# Altium schematic sheet ColourConverter.SchDoc: LiveDesign Evaluation - EvalBoard Tester
size A4; Organization: Altium Limited; Address1: L3, 12a Rodborough Rd; Address2: Frenchs Forest; Address3: NSW; Address4: Australia 2086; DocumentNumber: 9; SheetNumber: 9; SheetTotal: 16
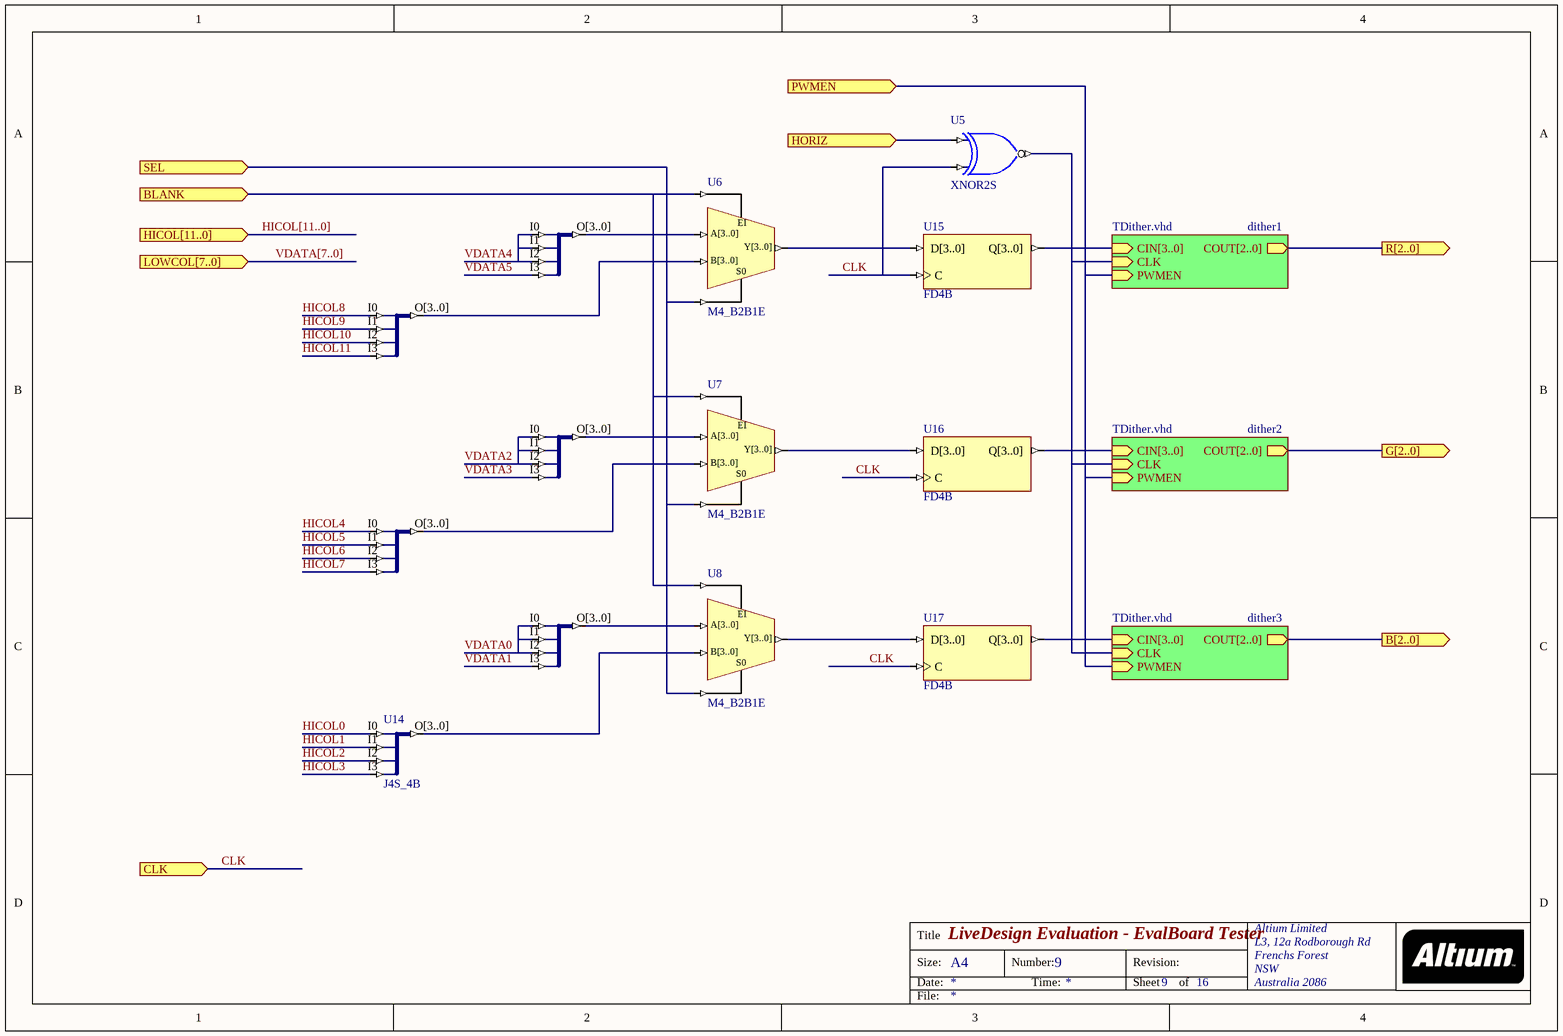
[diagram p0: ColourConverter.SchDoc]

## Parts
U5  XNOR2S
U6  M4_B2B1E
U7  M4_B2B1E
U8  M4_B2B1E
U9  J4S_4B  (value not drawn)
U10  J4S_4B  (value not drawn)
U11  J4S_4B  (value not drawn)
U12  J4S_4B  (value not drawn)
U13  J4S_4B  (value not drawn)
U14  J4S_4B
U15  FD4B
U16  FD4B
U17  FD4B

## Sub-sheets
dither1 = TDither.vhd: CIN[3..0] (in), COUT[2..0] (out), CLK (in), PWMEN (in)
dither2 = TDither.vhd: CIN[3..0] (in), COUT[2..0] (out), CLK (in), PWMEN (in)
dither3 = TDither.vhd: CIN[3..0] (in), COUT[2..0] (out), CLK (in), PWMEN (in)

## Ports
B[2..0] (out), BLANK (in), CLK (in), G[2..0] (out), HICOL[11..0] (in), HORIZ (in), LOWCOL[7..0] (in), PWMEN (in), R[2..0] (out), SEL (in)

## Nets
BLANK: U6.EI U7.EI U8.EI ; port BLANK
CLK: U5.I1 U15.C U16.C U17.C ; port CLK
HICOL0: U14.I0
HICOL1: U14.I1
HICOL2: U14.I2
HICOL3: U14.I3
HICOL4: U12.I0
HICOL5: U12.I1
HICOL6: U12.I2
HICOL7: U12.I3
HICOL8: U10.I0
HICOL9: U10.I1
HICOL10: U10.I2
HICOL11: U10.I3
HORIZ: U5.I0 ; port HORIZ
PWMEN: port PWMEN, sheet dither1/PWMEN, sheet dither2/PWMEN, sheet dither3/PWMEN
SEL: U6.S0 U7.S0 U8.S0 ; port SEL
VDATA0: U13.I0 U13.I1 U13.I2
VDATA1: U13.I3
VDATA2: U11.I0 U11.I1 U11.I2
VDATA3: U11.I3
VDATA4: U9.I0 U9.I1 U9.I2
VDATA5: U9.I3
NetU5_O: U5.O ; sheet dither1/CLK, sheet dither2/CLK, sheet dither3/CLK
NetU6_A[3..0]: U6.A[3..0] U9.O[3..0]
NetU6_B[3..0]: U6.B[3..0] U10.O[3..0]
NetU6_Y[3..0]: U6.Y[3..0] U15.D[3..0]
NetU7_A[3..0]: U7.A[3..0] U11.O[3..0]
NetU7_B[3..0]: U7.B[3..0] U12.O[3..0]
NetU7_Y[3..0]: U7.Y[3..0] U16.D[3..0]
NetU8_A[3..0]: U8.A[3..0] U13.O[3..0]
NetU8_B[3..0]: U8.B[3..0] U14.O[3..0]
NetU8_Y[3..0]: U8.Y[3..0] U17.D[3..0]
NetU15_Q[3..0]: U15.Q[3..0] ; sheet dither1/CIN[3..0]
NetU16_Q[3..0]: U16.Q[3..0] ; sheet dither2/CIN[3..0]
NetU17_Q[3..0]: U17.Q[3..0] ; sheet dither3/CIN[3..0]

## Buses and harness runs
bus HICOL[11..0] = port HICOL[11..0]
bus port B[2..0] = sheet dither3/COUT[2..0]
bus port G[2..0] = sheet dither2/COUT[2..0]
bus port R[2..0] = sheet dither1/COUT[2..0]
bus VDATA[7..0] = port LOWCOL[7..0]

## Notes on the sheet
- Title
- Size:
- Date:
- A4
- Number:
- Time:
- Revision:
- Sheet
- of
- File:

## Library data of the parts
U5 = XNOR2S: 2-Input Exclusive-NOR Gate, Single Pin Version; Xilinx Equivalent: XNOR2; ArchiveName: GENERIC; VHDLIB_SIM: GENERIC_LIB; Published: 29-Jan-2004; Publisher: Altium Limited; Core Revision: 1.00.00
U6-U8 = M4_B2B1E: 2x4-Bit Bus to 1x4-Bit Bus Multiplexer With Enable; ArchiveName: GENERIC; VHDLIB_SIM: GENERIC_LIB; Published: 29-Jan-2004; Publisher: Altium Limited; Core Revision: 1.00.00
U9-U14 = J4S_4B: 4 Single pin inputs to single 4-Bit output bus; ArchiveName: GENERIC; VHDLIB_SIM: GENERIC_LIB; Published: 29-Jan-2004; Publisher: Altium Limited; Core Revision: 1.00.00
U15-U17 = FD4B: 4-Bit D-Type Flip-Flop, Bus Version; ArchiveName: GENERIC; VHDLIB_SIM: GENERIC_LIB; Published: 29-Jan-2004; Publisher: Altium Limited; Core Revision: 1.00.00